# EAGLE design Hydro (EAGLE 5.11)
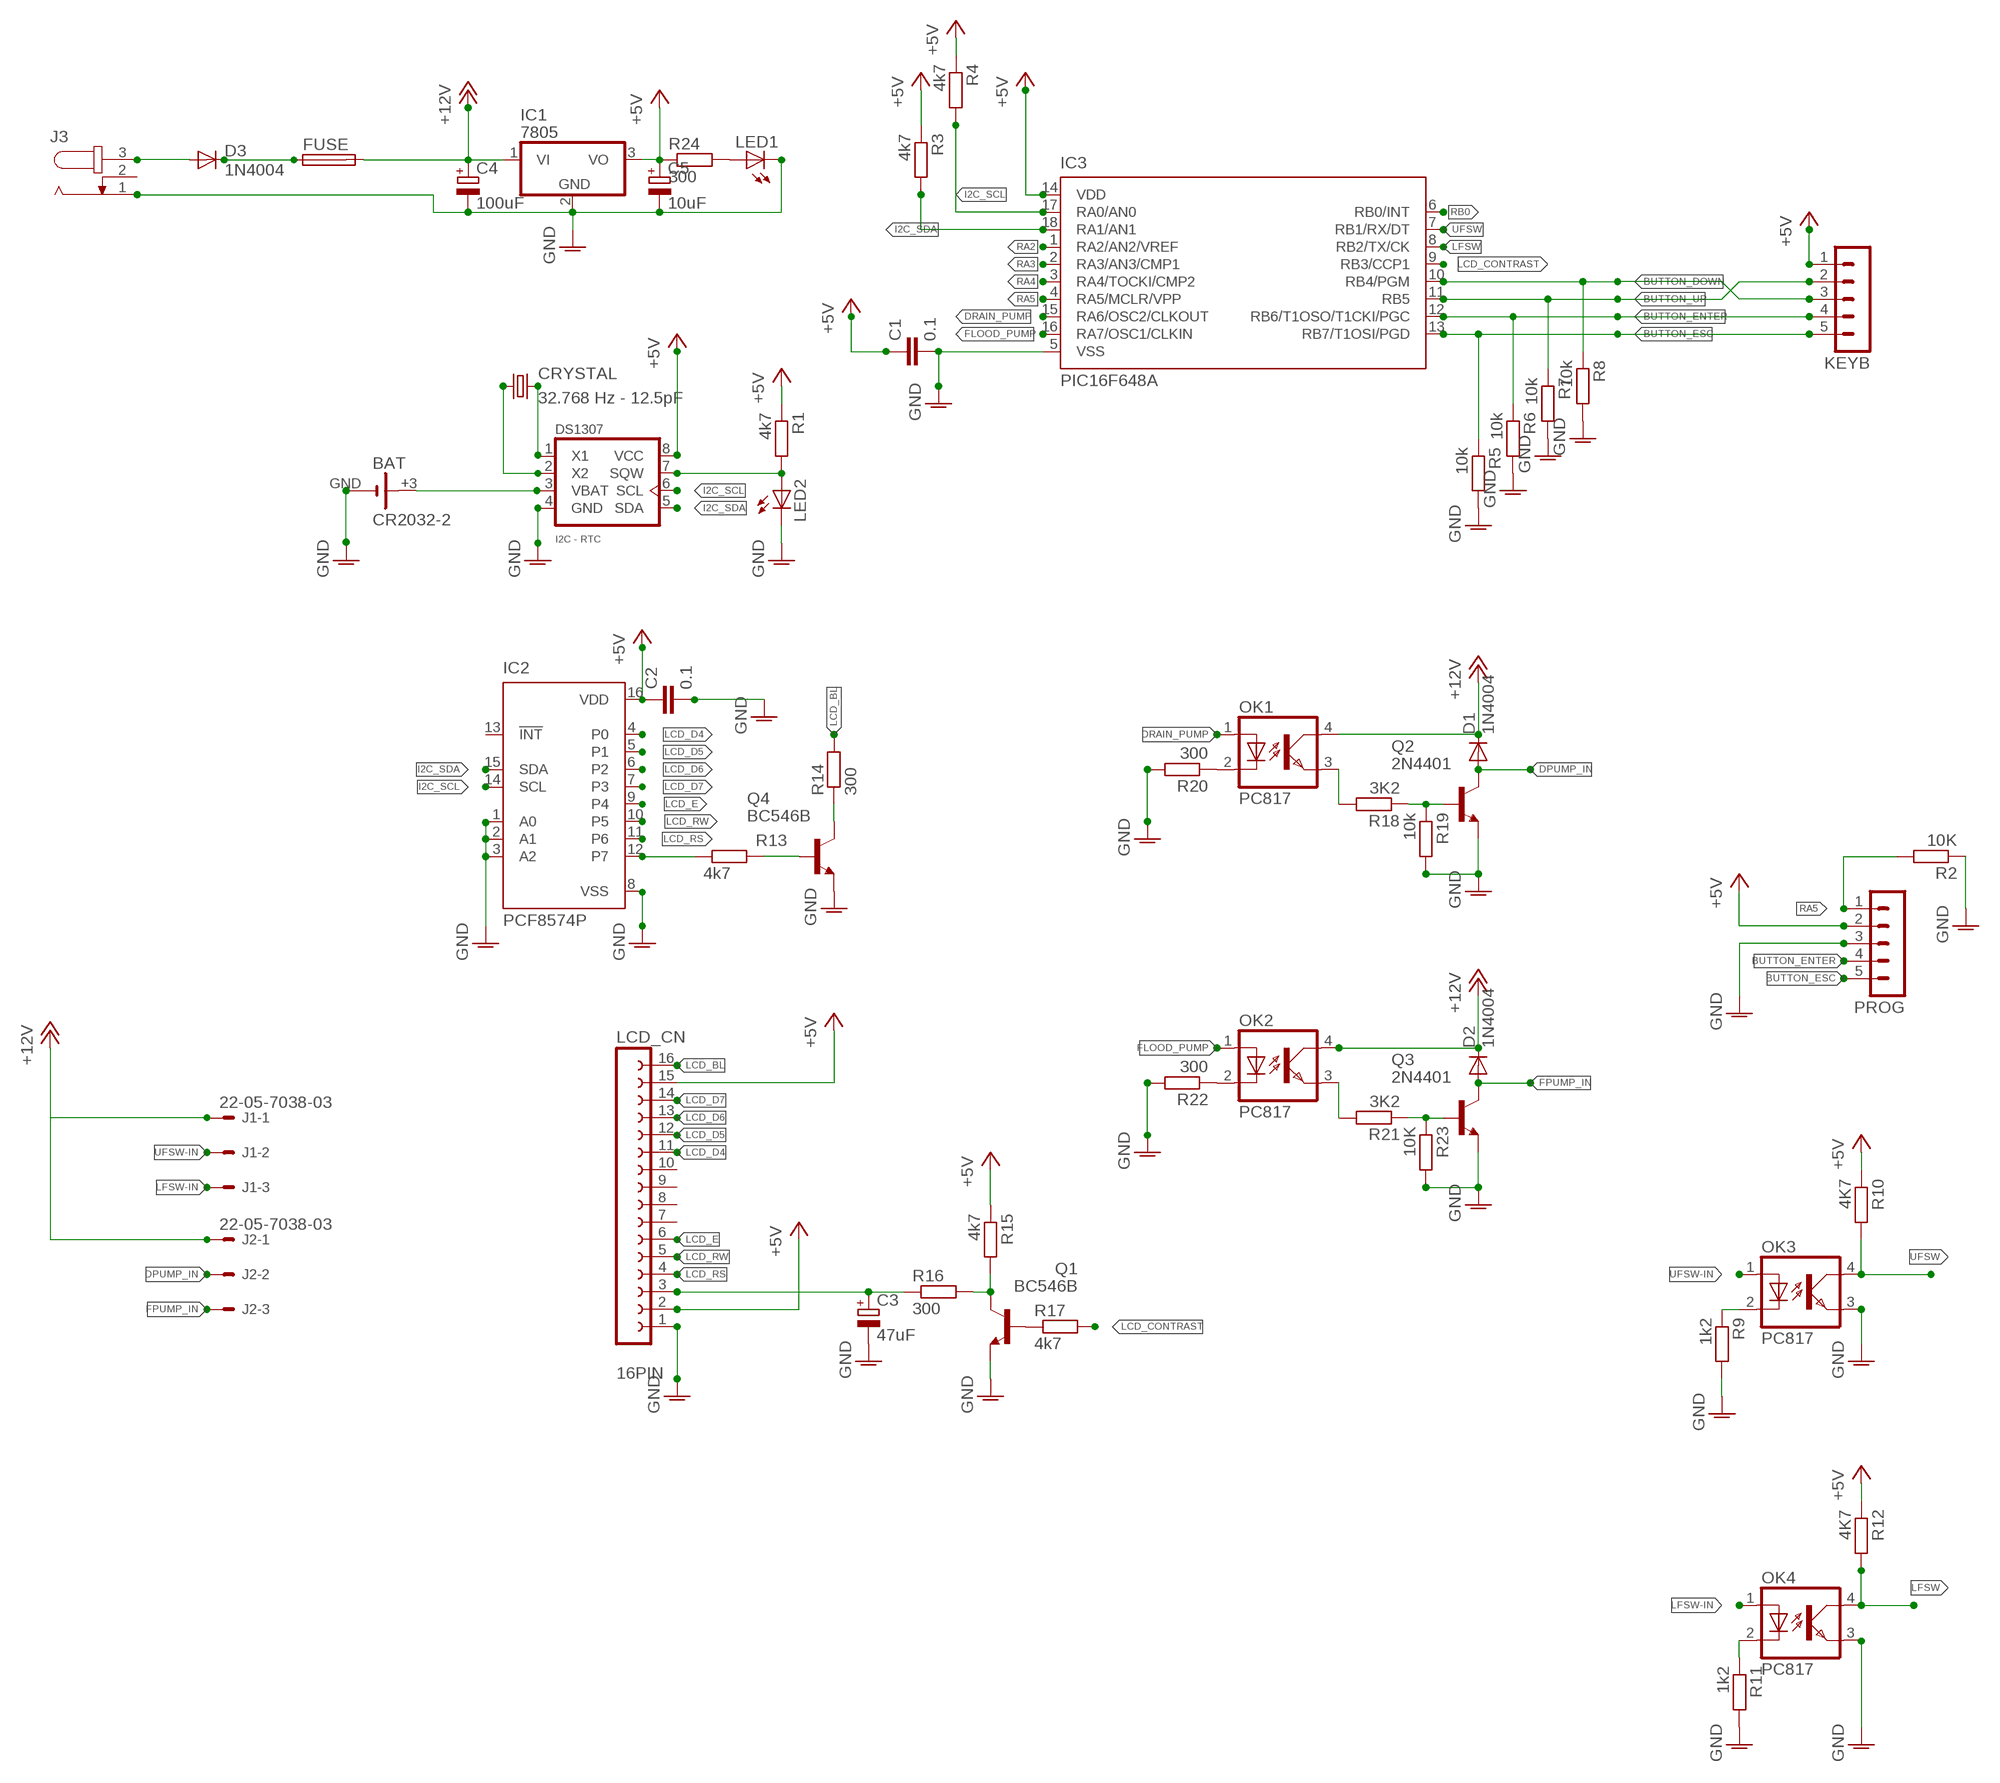
[diagram p0: schematic, sheet 1]

## Parts
BAT  CR2032-2  [CR2032-2]
C1  0.1  C-EU050-025X075  [C050-025X075]
C2  0.1  C-EU050-025X075  [C050-025X075]
C3  47uF  CPOL-EUE2.5-7  [E2,5-7]
C4  100uF  CPOL-EUE3.5-8  [E3,5-8]
C5  10uF  CPOL-EUE3.5-8  [E3,5-8]
CRYSTAL  32.768 Hz - 12.5pF  CRYTALTC38H  [TC38H]
D1  1N4004  [DO41-10]
D2  1N4004  [DO41-10]
D3  1N4004  [DO41-10]
FUSE  200mA  FUSESH22,5  [SH22,5]
IC1  7805  [TO220HH]
IC2  PCF8574P  [DIL16]
IC3  PIC16F648A  PIC16F628P  [DIL18]
J1  22-05-7038-03  [7395-03]
J2  22-05-7038-03  [7395-03]
J3  JACK-PLUG0  [SPC4077]
KEYB  MA05-1  [MA05-1]
LCD_CN  16PIN  [16PIN]
LED1  LED3MM  [LED3MM]
LED2  LED3MM  [LED3MM]
OK1  PC817  [DIL04]
OK2  PC817  [DIL04]
OK3  PC817  [DIL04]
OK4  PC817  [DIL04]
PROG  MA05-1  [MA05-1]
Q1  BC546B  [TO92-EBC]
Q2  2N4401  2N4401-NPN-TO92-EBC  [TO92-EBC]
Q3  2N4401  2N4401-NPN-TO92-EBC  [TO92-EBC]
Q4  BC546B  [TO92-EBC]
R1  4k7  R-EU_0207/10  [0207/10]
R2  10K  R-EU_0207/10  [0207/10]
R3  4k7  R-EU_0207/10  [0207/10]
R4  4k7  R-EU_0207/10  [0207/10]
R5  10k  R-EU_0207/10  [0207/10]
R6  10k  R-EU_0207/10  [0207/10]
R7  10k  R-EU_0207/10  [0207/10]
R8  10k  R-EU_0207/10  [0207/10]
R9  1k2  R-EU_0207/10  [0207/10]
R10  4K7  R-EU_0207/10  [0207/10]
R11  1k2  R-EU_0207/10  [0207/10]
R12  4K7  R-EU_0207/10  [0207/10]
R13  4k7  R-EU_0207/10  [0207/10]
R14  300  R-EU_0207/10  [0207/10]
R15  4k7  R-EU_0207/10  [0207/10]
R16  300  R-EU_0207/10  [0207/10]
R17  4k7  R-EU_0207/10  [0207/10]
R18  3K2  R-EU_0207/10  [0207/10]
R19  10k  R-EU_0207/10  [0207/10]
R20  300  R-EU_0207/10  [0207/10]
R21  3K2  R-EU_0207/10  [0207/10]
R22  300  R-EU_0207/10  [0207/10]
R23  10K  R-EU_0207/10  [0207/10]
R24  300  R-EU_0207/10  [0207/10]
U$1  DS1307  [DS1307]

## Nets
+5V: C1.1 C2.1 C5.+ IC1.3(VO) IC2.16(VDD) IC3.14(VDD) KEYB.1 LCD_CN.2 LCD_CN.15 PROG.2 R1.1 R3.1 R4.1 R10.1 R12.1 R15.1 R24.1 U$1.8(VCC)
+12V: C4.+ D1.C D2.C FUSE.2 IC1.1(VI) J1.1 J2.1 OK1.4(COL) OK2.4(COL)
BUTTON_DOWN: IC3.10(RB4/PGM) KEYB.3 R8.1
BUTTON_ENTER: IC3.12(RB6/T1OSO/T1CKI/PGC) KEYB.4 PROG.4 R6.1
BUTTON_ESC: IC3.13(RB7/T1OSI/PGD) KEYB.5 PROG.5 R5.1
BUTTON_UP: IC3.11(RB5) KEYB.2 R7.1
DPUMP_IN: D1.A J2.2 Q2.C
DRAIN_PUMP: IC3.15(RA6/OSC2/CLKOUT) OK1.1(A)
FLOOD_PUMP: IC3.16(RA7/OSC1/CLKIN) OK2.1(A)
FPUMP_IN: D2.A J2.3 Q3.C
GNDA: BAT.GND(-) C1.2 C2.2 C3.- C4.- C5.- IC1.2(GND) IC2.1(A0) IC2.2(A1) IC2.3(A2) IC2.8(VSS) IC3.5(VSS) J3.1 LCD_CN.1 LED1.K(C) LED2.K(C) OK3.3(EMIT) OK4.3(EMIT) PROG.3 Q1.E Q2.E Q3.E Q4.E R2.1 R5.2 R6.2 R7.2 R8.2 R9.2 R11.2 R19.2 R20.2 R22.2 R23.2 U$1.4(GND) ; supply symbol labelled GND
I2C_SCL: IC2.14(SCL) IC3.17(RA0/AN0) R4.2 U$1.6(SCL)
I2C_SDA: IC2.15(SDA) IC3.18(RA1/AN1) R3.2 U$1.5(SDA)
LCD_BL: LCD_CN.16 R14.2
LCD_CONTRAST: IC3.9(RB3/CCP1) R17.2
LCD_D4: IC2.4(P0) LCD_CN.11
LCD_D5: IC2.5(P1) LCD_CN.12
LCD_D6: IC2.6(P2) LCD_CN.13
LCD_D7: IC2.7(P3) LCD_CN.14
LCD_E: IC2.9(P4) LCD_CN.6
LCD_RS: IC2.11(P6) LCD_CN.4
LCD_RW: IC2.10(P5) LCD_CN.5
LFSW: IC3.8(RB2/TX/CK) OK4.4(COL) R12.2
LFSW-IN: J1.3 OK4.1(A)
N$1: CRYSTAL.1 U$1.2(X2)
N$2: LED2.A R1.2 U$1.7(SQW)
N$3: C3.+ LCD_CN.3 R16.1
N$4: IC2.12(P7) R13.1
N$5: OK3.2(C) R9.1
N$6: Q4.B R13.2
N$7: OK2.3(EMIT) R21.2
N$8: D3.A J3.3
N$9: OK1.3(EMIT) R18.2
N$10: CRYSTAL.2 U$1.1(X1)
N$11: BAT.+3(+) U$1.3(VBAT)
N$12: Q1.B R17.1
N$13: Q1.C R15.2 R16.2
N$14: OK2.2(C) R22.1
N$15: Q3.B R21.1 R23.1
N$16: Q2.B R18.1 R19.1
N$17: OK1.2(C) R20.1
N$18: OK4.2(C) R11.1
N$19: Q4.C R14.1
N$21: LED1.A R24.2
N$22: D3.C FUSE.1
RA2: IC3.1(RA2/AN2/VREF)
RA3: IC3.2(RA3/AN3/CMP1)
RA4: IC3.3(RA4/TOCKI/CMP2)
RA5: IC3.4(RA5/MCLR/VPP) PROG.1 R2.2
RB0: IC3.6(RB0/INT)
UFSW: IC3.7(RB1/RX/DT) OK3.4(COL) R10.2
UFSW-IN: J1.2 OK3.1(A)
Unconnected: IC2.13(!INT) J3.2 LCD_CN.7 LCD_CN.8 LCD_CN.9 LCD_CN.10

## Library data of the parts
BAT = battery-tcop:CR2032-2
C1 C2 = rcl:C-EU: CAPACITOR, European symbol
C3 = rcl:CPOL-EU: POLARIZED CAPACITOR, European symbol
C4 C5 = resistor:CPOL-EU: POLARIZED CAPACITOR, European symbol
CRYSTAL = crystal:CRYTAL: CRYSTAL
D1-D3 = diode:1N4004: DIODE general purpose rectifier, 1 A
FUSE = fuse:FUSE: Fuse; OC_FARNELL: unknown; OC_NEWARK: unknown
IC1 = linear:78*: Positive VOLTAGE REGULATOR Source: http://cache.national.com/ds/LM/LM78L05.pdf http://www.fairchildsemi.com/ds/LM/LM7805.pdf
IC2 = micro-philips:PCF8574: I2C-Bus Remote 8-bit I/O expander http://www.semiconductors.philips.com/acrobat_download/datasheets/PCF8574_4.pdf; MPN: PCF8574PN; OC_FARNELL: 204020; OC_NEWARK: 11N8515
IC3 = microchip:PIC16F62*: FLASH-Based 8-Bit CMOS Microcontroller Source: http://ww1.microchip.com/downloads/en/DeviceDoc/40300C.pdf; MF: MICROCHIP; MPN: PIC16F628-04I/P; OC_FARNELL: 9760407; OC_NEWARK: 19C7272
J1 J2 = con-molex:22-?-03: CONNECTOR wire to board 2.54 mm (.1 inch) pitch header; OC_FARNELL: unknown; OC_NEWARK: unknown
J3 = con-jack:JACK-PLUG: DC POWER JACK Power Jack, DC, Right Angle, Through Hole, Rated 5A at 16VDC, PC Terminals Distributor: Farnell (www.Farnell.de) Drawing: 84N1161.pdf / 84N1162.pdf Manufacturer: SPC Technology (www.spctechnology.com) Type: SPC4077 / SPC 4078
KEYB PROG = con-lstb:MA05-1: PIN HEADER; OC_FARNELL: unknown; OC_NEWARK: unknown
LCD_CN = con-lsta-tcop:16PIN
LED1 LED2 = led:LED: LED OSRAM: - CHIPLED LG R971, LG N971, LY N971, LG Q971, LY Q971, LO R971, LY R971 LH N974, LH R974 LS Q976, LO Q976, LY Q976 LO Q996 - Hyper CHIPLED LW Q18S LB Q993, LB Q99A, LB R99A - SideLED LS A670, LO A670, LY A670, LG A670, LP A670 LB A673, LV A673, LT A673, LW A673 LH A674 LY A675 LS A676, LA A676, LO A676, LY A676, LW A676 LS A679, LY A679, LG A679 - Hyper Micro SIDELED® LS Y876, LA Y876, LO Y876, LY Y876 LT Y87S - SmartLED LW L88C, LW L88S LB L89C, LB L89S, LG L890 LS L89K, LO L89K, LY L89K LS L896, LA L896, LO L896, LY L896 - TOPLED LS T670, LO T670, LY T670, LG T670, LP T670 LSG T670, LSP T670, LSY T670, LOP T670, LYG T670 LG T671, LOG T671, LSG T671 LB T673, LV T673, LT T673, LW T673 LH T674 LS T676, LA T676, LO T676, LY T676, LB T676, LH T676, LSB T676, LW T676 LB T67C, LV T67C, LT T67C, LS T67K, LO T67K, LY T67K, LW E67C LS E67B, LA E67B, LO E67B, LY E67B, LB E67C, LV E67C, LT E67C LW T67C LS T679, LY T679, LG T679 LS T770, LO T770, LY T770, LG T770, LP T770 LB T773, LV T773, LT T773, LW T773 LH T774 LS E675, LA E675, LY E675, LS T675 LS T776, LA T776, LO T776, LY T776, LB T776 LHGB T686 LT T68C, LB T68C - Hyper Mini TOPLED® LB M676 - Mini TOPLED Santana® LG M470 LS M47K, LO M47K, LY M47K Source: http://www.osram.convergy.de LUXEON: - LUMILED® LXK2-PW12-R00, LXK2-PW12-S00, LXK2-PW14-U00, LXK2-PW14-V00 LXK2-PM12-R00, LXK2-PM12-S00, LXK2-PM14-U00 LXK2-PE12-Q00, LXK2-PE12-R00, LXK2-PE12-S00, LXK2-PE14-T00, LXK2-PE14-U00 LXK2-PB12-K00, LXK2-PB12-L00, LXK2-PB12-M00, LXK2-PB14-N00, LXK2-PB14-P00, LXK2-PB14-Q00 LXK2-PR12-L00, LXK2-PR12-M00, LXK2-PR14-Q00, LXK2-PR14-R00 LXK2-PD12-Q00, LXK2-PD12-R00, LXK2-PD12-S00 LXK2-PH12-R00, LXK2-PH12-S00 LXK2-PL12-P00, LXK2-PL12-Q00, LXK2-PL12-R00 Source: www.luxeon.com KINGBRIGHT: KA-3528ASYC Source: www.kingbright.com
OK1-OK4 = optocoupler:PC817: SHARP OPTO COUPLER; MPN: PC817X4J000F; OC_FARNELL: 9707727; OC_NEWARK: 97K7059
Q1 Q4 = transistor-npn:BC546*: NPN Transistor
Q2 Q3 = transistor-neu-to92:*-NPN-: NPN Transistror
R1-R24 = resistor:R-EU_: RESISTOR, European symbol
U$1 = DS1307:DS1307: REAL TIME CLOCK MAXIM DS1307 8 PIN PDIP

## Net classes
0 default: width 0.406 mm, clearance 0.61 mm
1 GND: width 0.406 mm, clearance 0.61 mm
2 +12V: width 0.61 mm, clearance 0.61 mm

## Board
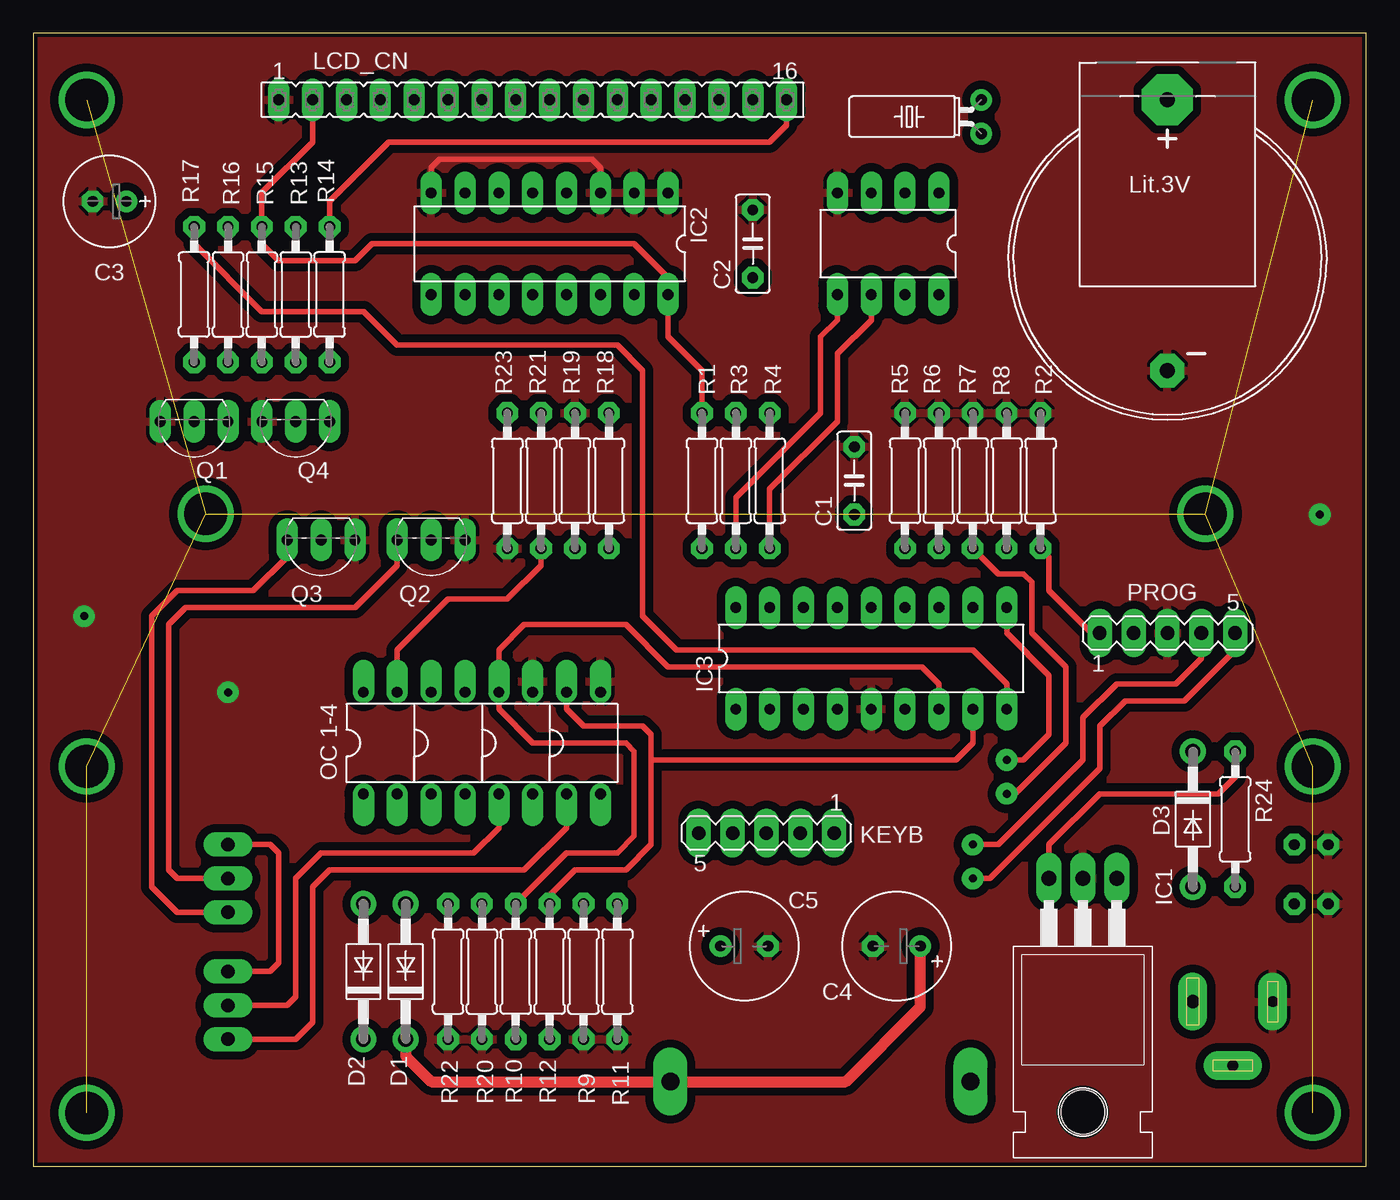
[diagram p1: board, top side]
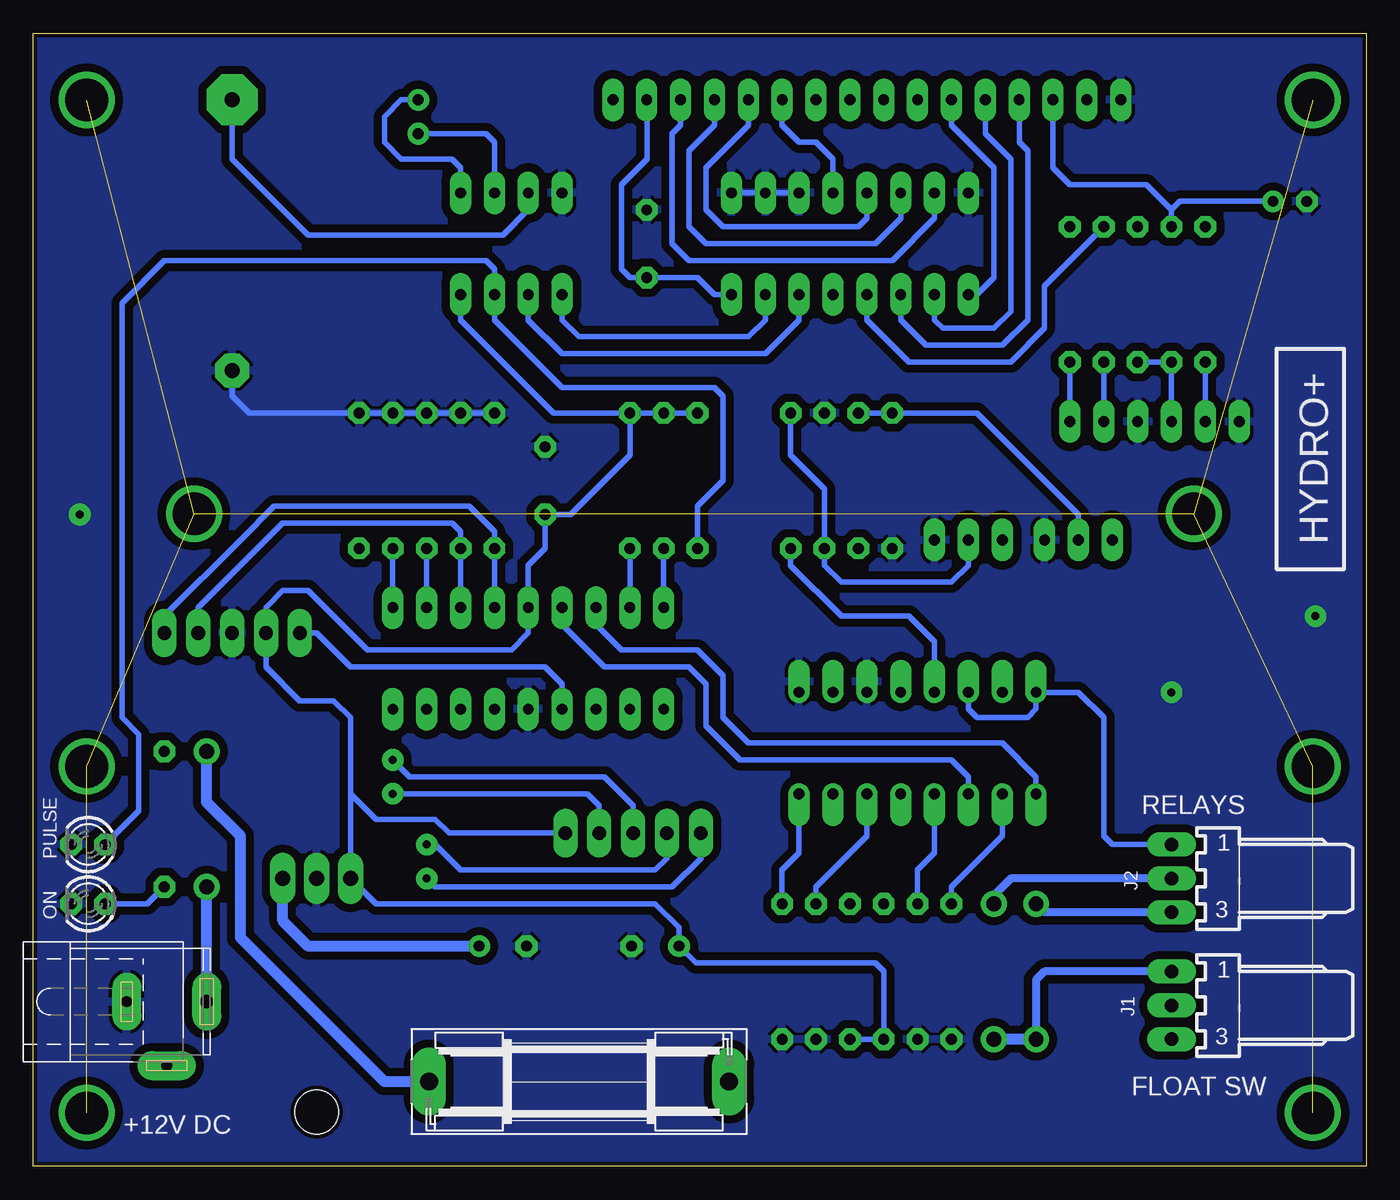
[diagram p2: board, bottom side, seen from below]

Size 100 x 85 mm. Coordinates in mm from the lower left corner, seen from the top.
Outline: 0,0 100,0 100,85 0,85 0,0
Copper layers (1*16): Top 0.035mm / dielectric 1.5mm / Bottom 0.035mm
Design rules "test *": minimum track width 16mil, minimum drill 20mil, track to track 16mil, track to pad 16mil, pad to pad 16mil, via to via 16mil, smd to smd 8mil, copper to edge 10mil, drill to drill 8mil, minimum pad ring 16mil, minimum via ring 20mil, stop-mask expansion 2mil, vias tented up to drill 25mil, thermal gap 10mil

### Footprints (pad centres in the part's own frame; a part is rotated, then mirrored left to right if it is on the bottom)
CR2032-2 = drill 1.118 pad 3.81 octagon: +3 0,9.525 | drill 1.118 pad 2.54 octagon: GND 0,-10.795
C050-025X075 = drill 0.813 octagon: 1 -2.54,0; 2 2.54,0
E2,5-7 = drill 0.813 pad 1.6 round: + -1.27,0 | drill 0.813 pad 1.6 octagon: - 1.27,0
E3,5-8 = drill 0.813 pad 1.6 round: + -1.778,0 | drill 0.813 pad 1.6 octagon: - 1.778,0
TC38H = drill 0.813 round: 1 -1.27,0; 2 1.27,0
DO41-10 = drill 1.118 round: A 5.08,0; C -5.08,0
SH22,5 = drill 1.321 pad 2.54 long: 1 -11.252,0; 2 11.252,0
TO220HH = drill 1.118 long: 1 -2.54,-10.16; 2 0,-10.16; 3 2.54,-10.16 | hole 3.302: 0,7.366
DIL16 = drill 0.813 long: 1 -8.89,-3.81; 2 -6.35,-3.81; 3 -3.81,-3.81; 4 -1.27,-3.81; 5 1.27,-3.81; 6 3.81,-3.81; 7 6.35,-3.81; 8 8.89,-3.81; 9 8.89,3.81; 10 6.35,3.81; 11 3.81,3.81; 12 1.27,3.81; 13 -1.27,3.81; 14 -3.81,3.81; 15 -6.35,3.81; 16 -8.89,3.81
DIL18 = drill 0.813 long: 1 -10.16,-3.81; 2 -7.62,-3.81; 3 -5.08,-3.81; 4 -2.54,-3.81; 5 0,-3.81; 6 2.54,-3.81; 7 5.08,-3.81; 8 7.62,-3.81; 9 10.16,-3.81; 10 10.16,3.81; 11 7.62,3.81; 12 5.08,3.81; 13 2.54,3.81; 14 0,3.81; 15 -2.54,3.81; 16 -5.08,3.81; 17 -7.62,3.81; 18 -10.16,3.81
7395-03 = drill 1.016 long: 1 2.54,0; 2 0,0; 3 -2.54,0
SPC4077 = drill 0.8 pad 2.184 long: 1 -3,0; 2 0,-4.8 | drill 1 pad 2.184 long: 3 3,0
MA05-1 = drill 1.016 long: 1 -5.08,0; 2 -2.54,0; 3 0,0; 4 2.54,0; 5 5.08,0
16PIN = drill 0.813 long: 1 -19.05,0; 2 -16.51,0; 3 -13.97,0; 4 -11.43,0; 5 -8.89,0; 6 -6.35,0; 7 -3.81,0; 8 -1.27,0; 9 1.27,0; 10 3.81,0; 11 6.35,0; 12 8.89,0; 13 11.43,0; 14 13.97,0; 15 16.51,0; 16 19.05,0
LED3MM = drill 0.813 octagon: A -1.27,0; K 1.27,0
DIL04 = drill 0.813 offset: 1 -1.27,-3.81; 2 1.27,-3.81; 3 1.27,3.81; 4 -1.27,3.81
TO92-EBC = drill 0.813 long: B 0,-1.27; C -2.54,-1.27; E 2.54,-1.27
TO92-EBC' = drill 0.813 long: B 0,-1.27; C 2.54,-1.27; E -2.54,-1.27
0207/10 = drill 0.813 octagon: 1 -5.08,0; 2 5.08,0
DS1307 = drill 0.813 long: 1 -3.81,-3.81; 2 -1.27,-3.81; 3 1.27,-3.81; 4 3.81,-3.81; 5 3.81,3.81; 6 1.27,3.81; 7 -1.27,3.81; 8 -3.81,3.81

### Placement (x,y rotation side)
BAT  85.09,70.48 0 top
C1  61.59,51.44 90 top
C2  53.98,69.22 90 top
C3  5.71,72.39 180 top
C4  64.77,16.51 180 top
C5  53.34,16.51 0 top
CRYSTAL  71.12,78.74 90 top
D1  27.94,14.61 90 top
D2  24.77,14.61 90 top
D3  87,26.04 270 top
FUSE  59.05,6.35 0 bottom
IC1  78.74,11.43 180 top
IC2  38.73,69.22 180 top
IC3  62.87,38.1 0 top
J1  14.61,12.06 90 bottom
J2  14.61,21.59 90 bottom
J3  89.99,12.34 0 bottom
KEYB  55,25 180 top
LCD_CN  37.47,80.01 0 top
LED1  95.89,19.68 180 bottom
LED2  95.89,24.13 180 bottom
OK1  31.11,31.75 0 top
OK2  26.04,31.75 0 top
OK3  36.2,31.75 0 top
OK4  41.27,31.75 0 top
PROG  85.09,40.01 0 top
Q1  12.06,54.61 180 top
Q2  2N4401  [TO92-EBC']  29.84,45.72 180 top
Q3  2N4401  [TO92-EBC']  21.59,45.72 180 top
Q4  19.68,54.61 180 top
R1  50.16,51.44 270 top
R2  75.56,51.44 270 top
R3  52.7,51.44 270 top
R4  55.24,51.44 270 top
R5  65.41,51.44 90 top
R6  67.94,51.44 90 top
R7  70.48,51.44 90 top
R8  73.03,51.44 90 top
R9  41.27,14.61 270 top
R10  36.2,14.61 90 top
R11  43.81,14.61 270 top
R12  38.73,14.61 90 top
R13  19.68,65.41 270 top
R14  22.23,65.41 90 top
R15  17.14,65.41 270 top
R16  14.61,65.41 270 top
R17  12.06,65.41 90 top
R18  43.18,51.44 270 top
R19  40.64,51.44 90 top
R20  33.66,14.61 270 top
R21  38.1,51.44 270 top
R22  31.11,14.61 270 top
R23  35.56,51.44 270 top
R24  90.17,26.04 270 top
U$1  64.14,69.22 180 top

### Tracks (layer width: path | path; a pad name or v marks a point on that pad's centre or on a via)
+5V
  Top 0.406: R1.1 50.16,59.69 47.62,62.23 IC2.16 47.62,66.67 45.09,69.22 25.4,69.22 24.13,67.94 18.41,67.94 17.14,69.22 R15.1 17.14,73.03 20.95,76.83 LCD_CN.2 | R24.1 90.17,29.21 88.9,27.94 80.01,27.94 76.2,24.13 IC1.3
  Bottom 0.406: U$1.8 67.94,63.5 60.96,56.52 R1.1 R3.1 R4.1 55.24,53.34 59.69,48.9 C1.1 61.59,46.35 62.87,45.09 IC3.14 62.87,40.01 64.14,38.73 74.93,38.73 79.38,43.18 81.28,43.18 82.55,41.91 PROG.2 82.55,37.47 80.01,34.92 77.47,34.92 76.2,33.66 76.2,27.94 | R12.1 R10.1 36.2,14.61 36.83,15.24 50.29,15.24 C5.+ 51.56,17.91 53.34,19.68 74.3,19.68 IC1.3 76.2,27.94 | LCD_CN.15 53.98,75.56 55.88,73.66 55.88,67.31 55.24,66.67 C2.1 50.16,66.67 48.9,65.41 IC2.16 | KEYB.1 68.81,25 69.85,26.04 74.3,26.04 76.2,27.94
+12V
  Top 0.406: J1.1 17.78,14.61 18.41,15.24 18.41,23.5 17.78,24.13 J2.1
  Top 0.813: D1.C 27.94,8.26 29.84,6.35 FUSE.2 60.96,6.35 66.55,11.94 C4.+
  Bottom 0.406: OK1.4 29.84,34.29 29.21,33.66 25.4,33.66 24.77,34.29 OK2.4 21.59,35.56 19.68,33.66 19.68,24.77 19.05,24.13 J2.1
  Bottom 0.61: J1.1 24.13,14.61 24.77,13.97 D2.C
  Bottom 0.813: D2.C D1.C | C4.+ 79.38,16.51 81.28,18.41 IC1.1
BUTTON_DOWN  (via drill 0.6)
  Top 0.406: v73.03,30.48 74.3,30.48 76.2,32.38 76.2,36.83 73.03,40.01 IC3.10
  Bottom 0.406: IC3.10 R8.1 | KEYB.3 55,27.06 57.15,29.21 71.75,29.21 v73.03,30.48
BUTTON_ENTER  (via drill 0.6)
  Top 0.406: v70.48,24.13 72.39,24.13 78.74,30.48 78.74,33.66 81.28,36.2 85.72,36.2 87.63,38.1 PROG.4
  Bottom 0.406: IC3.12 R6.1 67.94,47.62 68.58,48.26 81.28,48.26 87.63,41.91 PROG.4 | v70.48,24.13 69.85,24.13 67.94,22.23 53.34,22.23 52.46,23.11 KEYB.4
BUTTON_ESC  (via drill 0.6)
  Top 0.406: v70.48,21.59 71.75,21.59 80.01,29.84 80.01,33.02 81.92,34.92 86.36,34.92 90.17,38.73 PROG.5
  Bottom 0.406: IC3.13 R5.1 65.41,47.62 67.31,49.53 81.92,49.53 84.45,46.99 | 84.45,46.99 85.09,46.35 | 84.45,46.99 90.17,41.27 PROG.5 | KEYB.5 49.92,23.11 52.07,20.95 69.85,20.95 v70.48,21.59
BUTTON_UP  (via drill 0.6)
  Top 0.406: R7.1 72.39,44.45 74.3,44.45 74.93,43.81 74.93,40.01 77.47,37.47 77.47,31.75 73.66,27.94 v73.03,27.94
  Bottom 0.406: R7.1 IC3.11 | KEYB.2 57.54,27.06 58.42,27.94 v73.03,27.94
DPUMP_IN
  Top 0.406: J2.2 10.79,21.59 10.16,22.23 10.16,40.64 11.43,41.91 24.13,41.91 27.3,45.09 Q2.C
  Bottom 0.61: J2.2 26.67,21.59 27.94,20.32 D1.A
DRAIN_PUMP
  Bottom 0.406: OK1.1 29.84,29.21 31.11,30.48 46.99,30.48 49.53,33.02 49.53,36.2 50.8,37.47 57.15,37.47 60.33,40.64 IC3.15
FLOOD_PUMP
  Bottom 0.406: OK2.1 24.77,29.21 27.3,31.75 46.35,31.75 48.26,33.66 48.26,36.83 50.16,38.73 55.88,38.73 57.78,40.64 IC3.16
FPUMP_IN
  Top 0.406: J2.3 10.79,19.05 8.89,20.95 8.89,41.27 10.79,43.18 16.51,43.18 19.05,45.72 Q3.C
  Bottom 0.61: J2.3 24.13,19.05 D2.A
GNDA  (via drill 0.6)
  Top 0.406: IC2.8 29.84,74.93 30.48,75.56 41.91,75.56 42.55,74.93 IC2.3
  Bottom 0.406: IC2.3 IC2.2 IC2.1 | R5.2 R6.2 R7.2 R8.2 R2.1 83.82,56.52 85.09,57.78 BAT.GND
  other vias: 14.61,35.56 96.52,48.9 3.81,41.27
  pour Bottom (isolate 0.305): 0,85.09 99.69,85.09 99.69,0 0,0
  pour Top (isolate 0.305): 0,85.09 99.69,85.09 99.69,0 0,0
I2C_SCL
  Top 0.406: R4.2 55.24,50.8 60.33,55.88 60.33,60.96 62.87,63.5 U$1.6
  Bottom 0.406: IC3.17 R4.2 | U$1.6 62.87,63.5 60.33,60.96 45.09,60.96 42.55,63.5 IC2.14
I2C_SDA
  Top 0.406: 60.33,64.77 U$1.5 60.33,63.5 59.05,62.23 59.05,56.52 52.7,50.16 R3.2
  Bottom 0.406: IC3.18 R3.2 | IC2.15 45.09,63.5 46.35,62.23 59.05,62.23 60.33,63.5 U$1.5
LCD_BL
  Top 0.406: R14.2 22.23,72.39 26.67,76.83 55.24,76.83 56.52,78.11 LCD_CN.16
LCD_CONTRAST
  Top 0.406: IC3.9 73.03,36.2 70.48,38.73 48.26,38.73 45.72,41.27 45.72,59.69 43.81,61.59 27.3,61.59 24.77,64.14 17.14,64.14 12.06,69.22 R17.2
LCD_D4
  Bottom 0.406: IC2.4 40.01,75.56 41.27,76.83 42.55,76.83 43.81,78.11 LCD_CN.11
LCD_D5
  Bottom 0.406: IC2.5 37.47,71.12 38.1,70.48 48.26,70.48 49.53,71.75 49.53,74.93 46.35,78.11 LCD_CN.12
LCD_D6
  Bottom 0.406: IC2.6 34.92,71.12 36.83,69.22 49.53,69.22 50.8,70.48 50.8,76.2 48.9,78.11 LCD_CN.13
LCD_D7
  Bottom 0.406: IC2.7 32.38,71.12 35.56,67.94 50.8,67.94 52.07,69.22 52.07,77.47 51.44,78.11 LCD_CN.14
LCD_E
  Bottom 0.406: IC2.9 29.21,65.41 27.94,66.67 27.94,74.93 31.11,78.11 LCD_CN.6
LCD_RS
  Bottom 0.406: LCD_CN.4 26.04,76.83 25.4,76.2 25.4,63.5 27.3,61.59 33.02,61.59 34.92,63.5 IC2.11
LCD_RW
  Bottom 0.406: IC2.10 32.38,63.5 31.75,62.87 27.94,62.87 26.67,64.14 26.67,75.56 28.57,77.47 LCD_CN.5
LFSW
  Top 0.406: IC3.8 70.48,31.75 69.22,30.48 46.35,30.48 | 46.35,30.48 46.35,32.38 45.72,33.02 41.27,33.02 40.01,34.29 OK4.4 | 46.35,30.48 46.35,24.13 44.45,22.23 40.64,22.23 38.73,20.32 R12.2
LFSW-IN
  Top 0.406: J1.3 19.68,9.53 20.95,10.79 20.95,20.95 22.23,22.23 36.83,22.23 40.01,25.4 OK4.1
N$1
  Bottom 0.406: U$1.2 65.41,76.83 66.04,77.47 CRYSTAL.1
N$2
  Bottom 0.406: R1.2 50.16,49.53 48.26,51.44 48.26,57.78 48.9,58.42 60.33,58.42 65.41,63.5 U$1.7 65.41,67.31 66.04,67.94 90.17,67.94 93.34,64.77 93.34,33.66 92.08,32.38 92.08,26.67 LED2.A
N$3
  Bottom 0.406: C3.+ 13.97,72.39 14.61,71.75 | 14.61,71.75 R16.1 | 14.61,71.75 16.51,73.66 22.23,73.66 23.5,74.93 LCD_CN.3
N$4
  Bottom 0.406: R13.1 24.13,66.04 24.13,62.87 26.67,60.33 34.29,60.33 37.47,63.5 IC2.12
N$5
  Bottom 0.406: R9.1 41.27,20.95 37.47,24.77 OK3.2
N$6
  Bottom 0.406: Q4.B R13.2
N$7
  Top 0.406: OK2.3 27.3,38.73 31.11,42.55 35.56,42.55 38.1,45.09 R21.2
N$8
  Bottom 0.813: D3.A 87,11.71 J3.3
N$9
  Bottom 0.406: OK1.3 32.38,39.37 34.29,41.27 39.37,41.27 43.18,45.09 R18.2
N$10
  Bottom 0.406: U$1.1 67.94,74.93 68.58,75.56 72.39,75.56 73.66,76.83 73.66,78.74 72.39,80.01 CRYSTAL.2
N$11
  Bottom 0.406: U$1.3 62.87,71.75 64.77,69.85 79.38,69.85 85.09,75.56 BAT.+3
N$12
  Bottom 0.406: Q1.B R17.1
N$13
  Bottom 0.406: R15.2 R16.2 Q1.C
N$14
  Bottom 0.406: R22.1 31.11,20.95 27.3,24.77 OK2.2
N$15
  Bottom 0.406: R21.1 R23.1 29.21,56.52 21.59,48.9 Q3.B
N$16
  Bottom 0.406: R18.1 43.18,53.34 40.64,50.8 R19.1 40.64,45.09 39.37,43.81 31.11,43.81 29.84,45.09 Q2.B
N$17
  Bottom 0.406: OK1.2 32.38,23.5 33.66,22.23 R20.1
N$18
  Bottom 0.406: OK4.2 42.55,23.5 43.81,22.23 R11.1
N$19
  Bottom 0.406: Q4.C R14.1
N$21
  Bottom 0.406: LED1.A 91.44,19.68 R24.2
N$22
  Bottom 0.813: FUSE.1 73.66,6.35 84.45,17.14 84.45,24.77 87,27.3 D3.C
N$23  (via drill 3.2)  (7 unrouted)
  other vias: 4,4 4,30 4,80 96,80 96,30 96,4 12.93,48.95 87.93,48.95
RA5
  Top 0.406: PROG.1 79.38,40.01 76.2,43.18 76.2,45.72 R2.2
  Bottom 0.406: IC3.4 60.33,36.2 61.59,37.47 76.2,37.47 78.74,40.01 PROG.1
UFSW
  Top 0.406: R10.2 40.01,23.5 43.81,23.5 45.09,24.77 45.09,31.11 44.45,31.75 37.47,31.75 34.92,34.29 OK3.4 34.92,38.73 36.83,40.64 44.45,40.64 47.62,37.47 66.67,37.47 67.94,36.2 IC3.7
UFSW-IN
  Top 0.406: J1.2 19.05,12.06 19.68,12.7 19.68,21.59 21.59,23.5 33.02,23.5 34.92,25.4 OK3.1

### Text on the board
tNames: OC 1-4
bNames: HYDRO+ | PULSE | RELAYS | ON | FLOAT SW | +12V DC